# Altium schematic sheet DX-BT24-V4.0_SCH_Part_AD.SchDoc
size A4
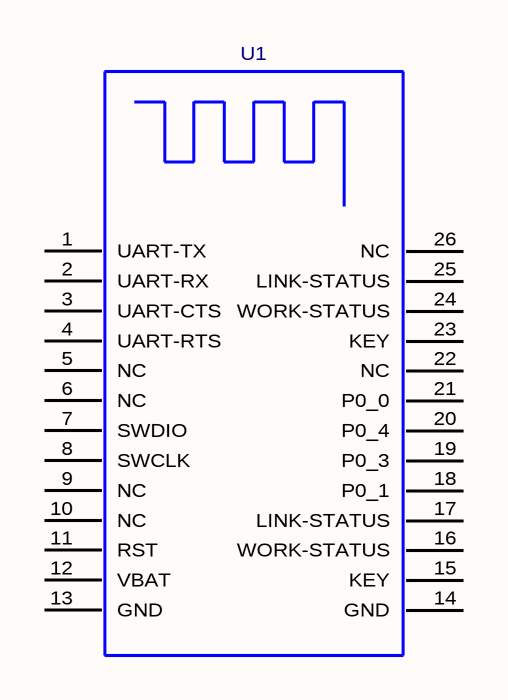
[diagram p0: DX-BT24-V4.0_SCH_Part_AD.SchDoc]

## Parts
U1  DX-BT24  [BT24-V2.0]  (value not drawn)

## Nets

Not connected (* = marked no-connect by the designer): U1 1(UART-TX) 2(UART-RX) 3(UART-CTS) 4(UART-RTS) 5(NC) 6(NC) 7(SWDIO) 8(SWCLK) 9(NC) 10(NC) 11(RST) 12(VBAT) 13(GND) 14(GND) 15(KEY) 16(WORK-STATUS) 17(LINK-STATUS) 18(P0_1) 19(P0_3) 20(P0_4) 21(P0_0) 22(NC) 23(KEY) 24(WORK-STATUS) 25(LINK-STATUS) 26(NC)

## Library data of the parts
U1 = DX-BT24: PCB DECAL: DX-BT24